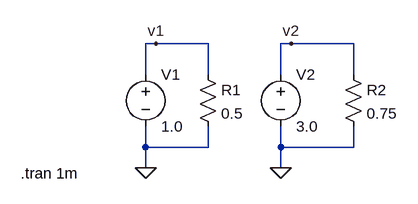
[diagram p0: schematic vsource.asc]
vsource.asc, the LTspice schematic file:
Version 4
SHEET 1 880 680
WIRE 144 112 128 112
WIRE 224 112 144 112
WIRE 352 112 336 112
WIRE 448 112 352 112
WIRE 128 160 128 112
WIRE 224 160 224 112
WIRE 336 160 336 112
WIRE 448 160 448 112
WIRE 128 272 128 240
WIRE 224 272 224 240
WIRE 224 272 128 272
WIRE 336 272 336 240
WIRE 448 272 448 240
WIRE 448 272 336 272
WIRE 128 304 128 272
WIRE 336 304 336 272
FLAG 128 304 0
FLAG 336 304 0
FLAG 144 112 v1
FLAG 352 112 v2
SYMBOL voltage 128 144 R0
SYMATTR InstName V1
SYMATTR Value 1.0
SYMBOL voltage 336 144 R0
SYMATTR InstName V2
SYMATTR Value 3.0
SYMBOL res 208 144 R0
SYMATTR InstName R1
SYMATTR Value 0.5
SYMBOL res 432 144 R0
SYMATTR InstName R2
SYMATTR Value 0.75
TEXT -64 312 Left 2 !.tran 1m

The netlist it stands for:
* vsource.asc
V1 v1 0 1.0
V2 v2 0 3.0
R1 v1 0 0.5
R2 v2 0 0.75
.tran 1m
.backanno
.end